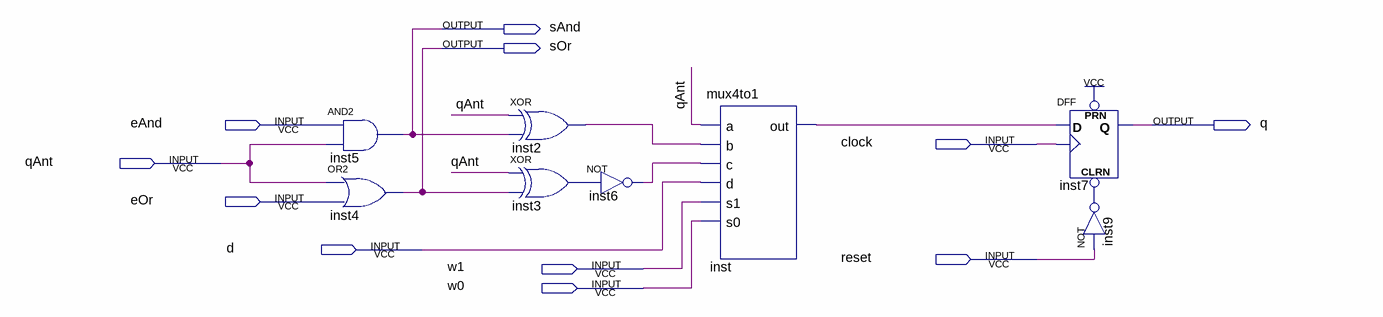
[diagram p0: schematic sheet]
// Quartus schematic contador_1bit.bdf as structural Verilog: 8 symbols, 11 pins
module contador_1bit (
  input  eAnd,
  input  clock,
  input  qAnt,
  input  eOr,
  input  d,
  input  reset,
  input  w1,
  input  w0,
  output sAnd,
  output sOr,
  output q
);

  wire inst2_out, inst3_out, inst6_out, inst9_out, inst_out;

  and inst5 (sAnd, eAnd, qAnt);
  or inst4 (sOr, qAnt, eOr);
  xor inst2 (inst2_out, qAnt, sAnd);
  xor inst3 (inst3_out, qAnt, sOr);
  not inst6 (inst6_out, inst3_out);
  mux4to1 inst (.a(qAnt), .b(inst2_out), .c(inst6_out), .d(d), .s1(w1), .s0(w0), .out(inst_out));
  DFF inst7 (.CLRN(inst9_out), .CLK(clock), .D(inst_out), .PRN(1'b1), .Q(q));
  not inst9 (inst9_out, reset);
endmodule
